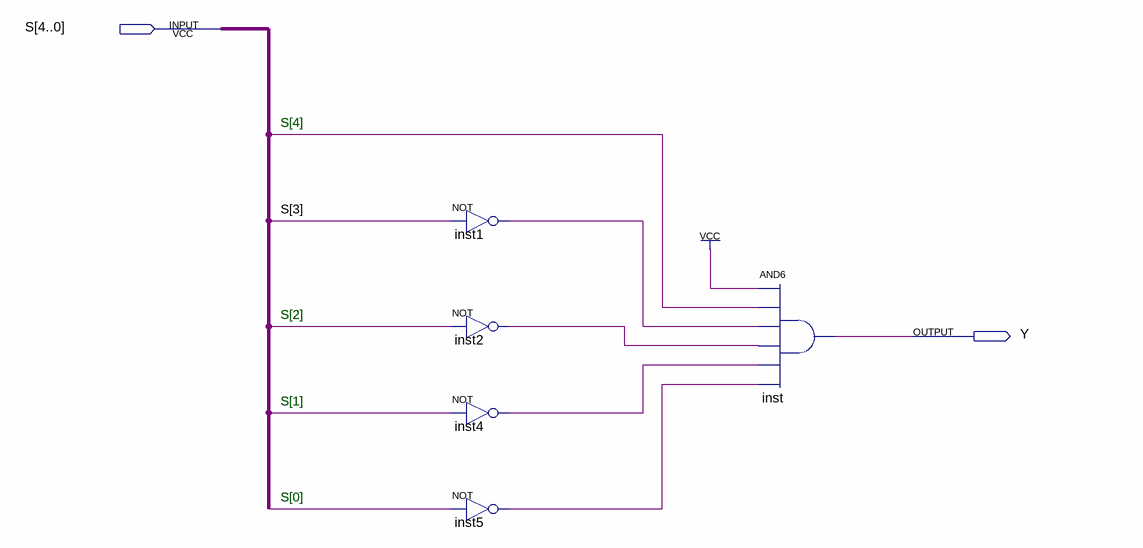
[diagram p0: schematic sheet]
// Quartus schematic S16.bdf as structural Verilog: 5 symbols, 2 pins
module S16 (
  input  [4:0] S,
  output Y
);

  wire inst1_out, inst2_out, inst4_out, inst5_out;

  not inst1 (inst1_out, S[3]);
  not inst2 (inst2_out, S[2]);
  not inst4 (inst4_out, S[1]);
  not inst5 (inst5_out, S[0]);
  and inst (Y, 1'b1, S[4], inst1_out, inst2_out, inst4_out, inst5_out);

  // Notes on the sheet:
  //   S[4]
  //   S[2]
  //   S[1]
  //   S[0]
endmodule
